# Altium project TL3572-EVM-A1.1-000-SCH-202609041404.PrjPcb (part 2 of 6)

## Sheet P04_POWER01.SchDoc
size 420 x 297 mm
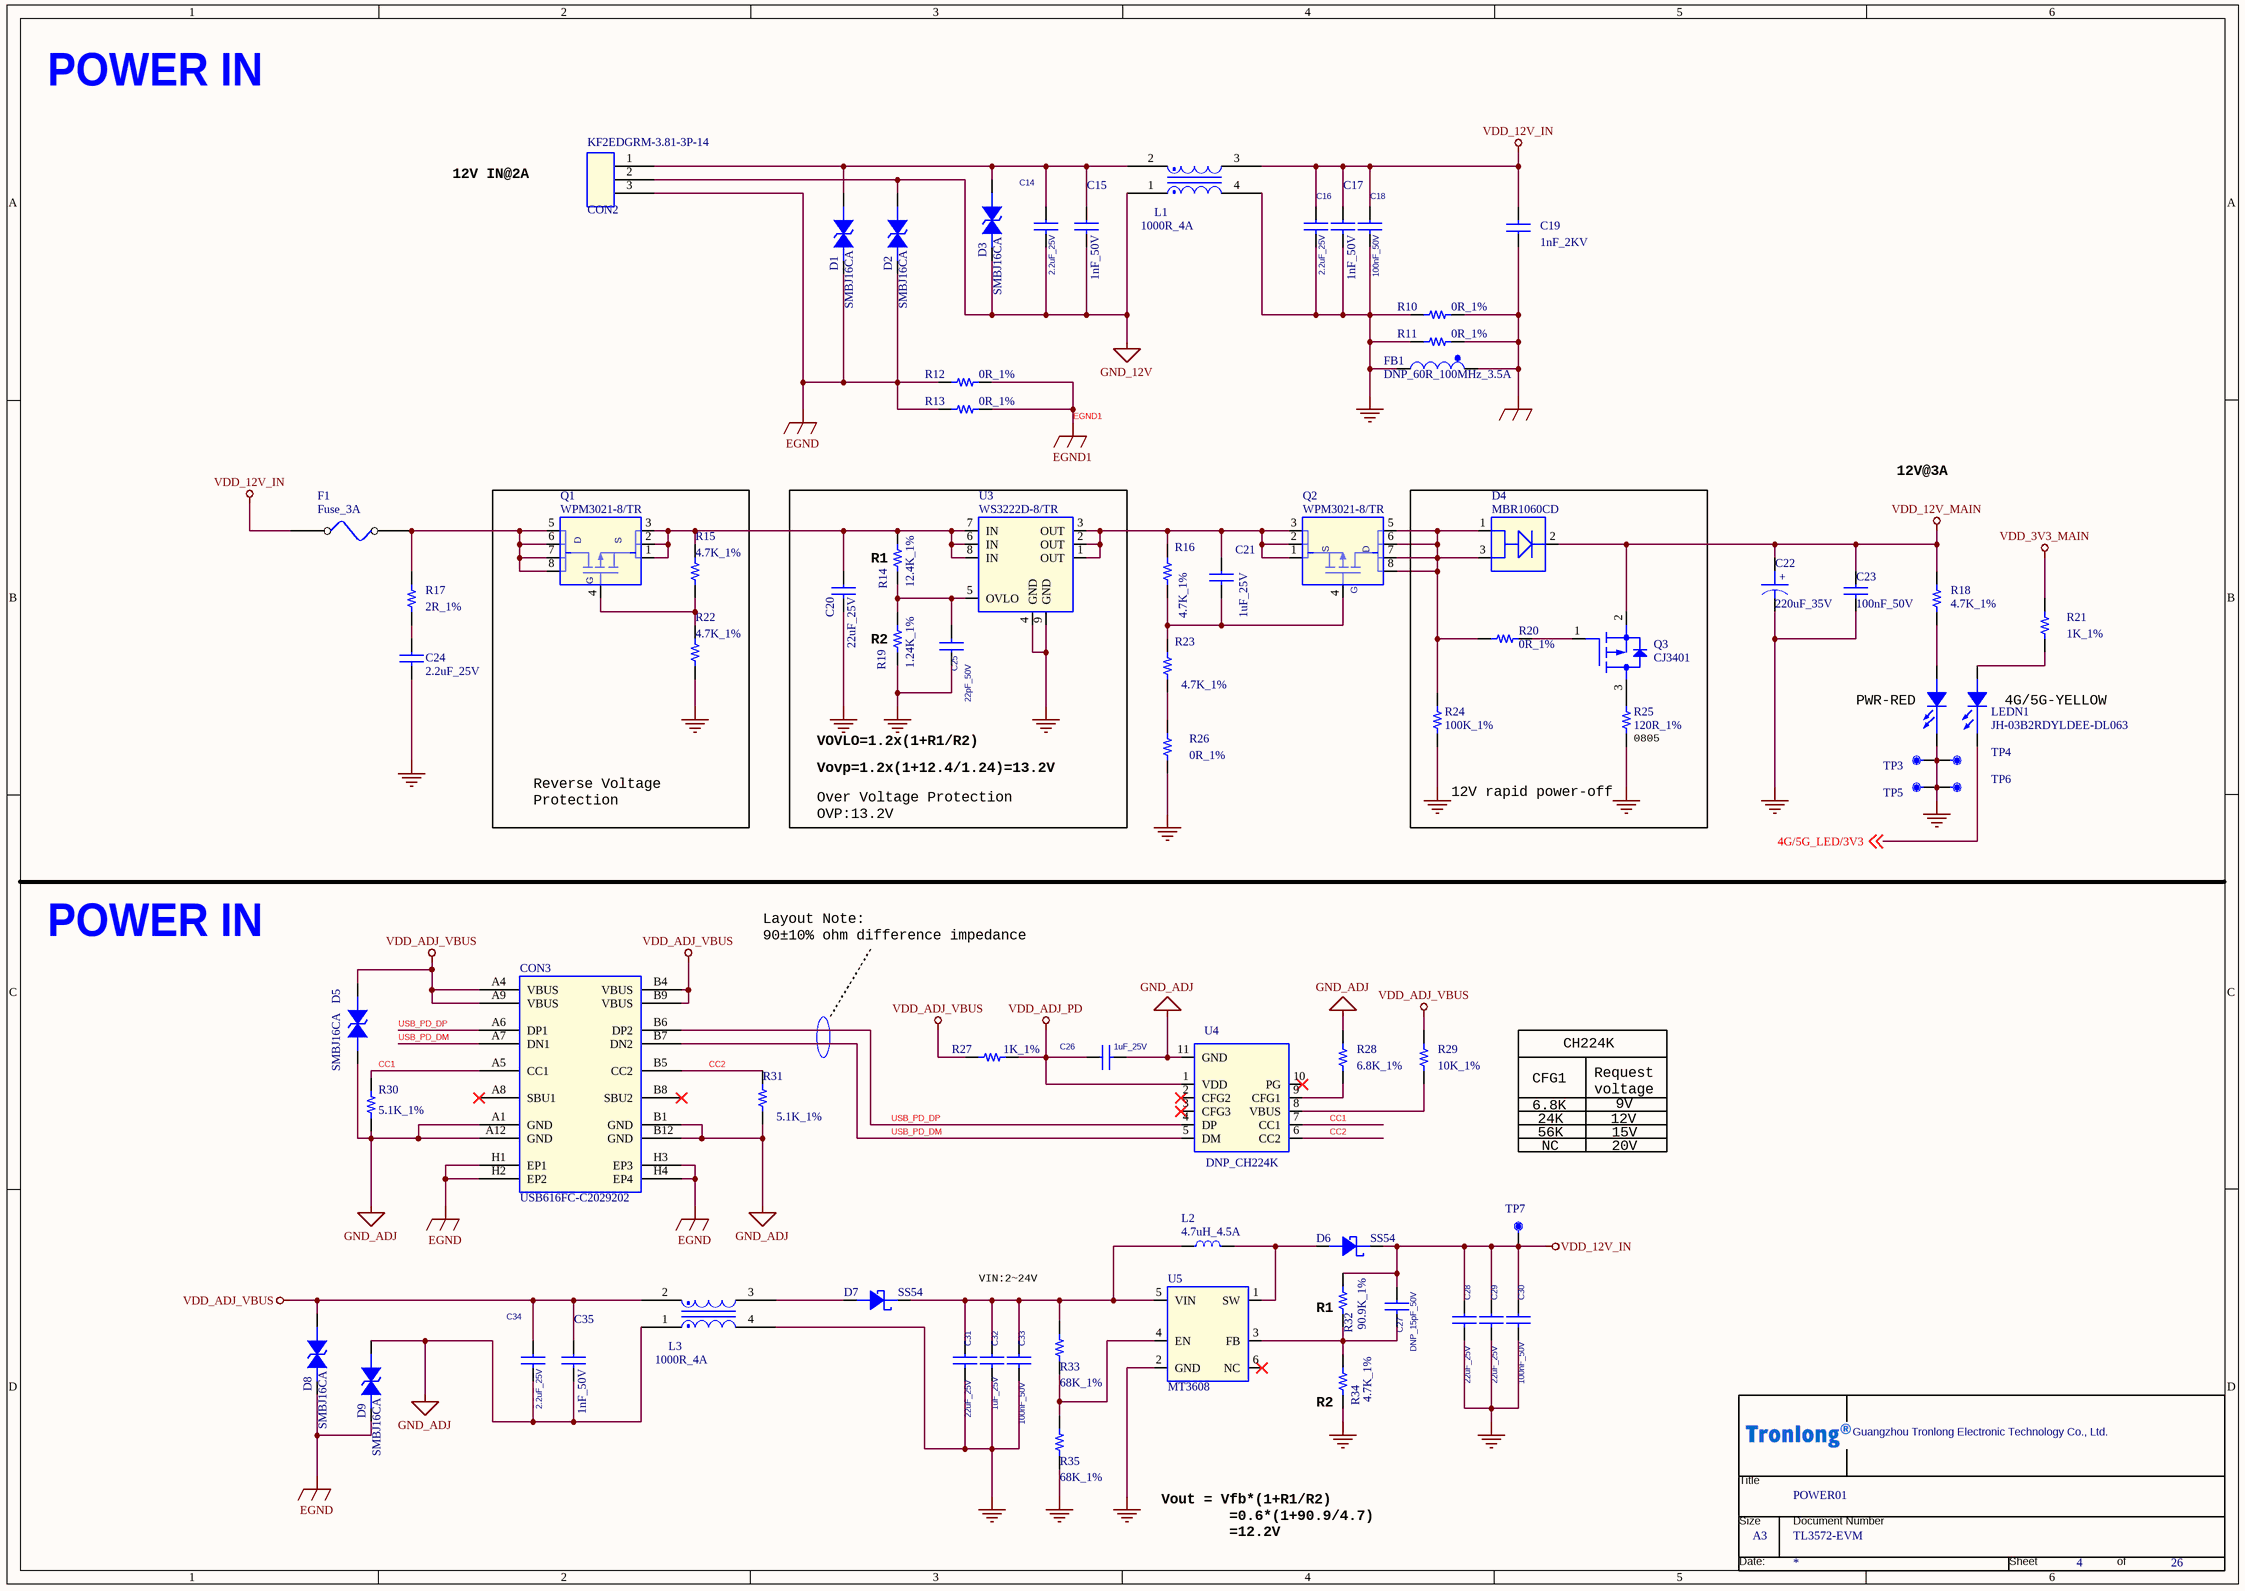
[diagram p6: P04_POWER01.SchDoc]

### Parts
(Parts that share a designator on the sheet are numbered #1, #2 ... from top to bottom, then left to right.)
*#2  Doc: TL3572-EVM  Title: POWER01  OrgName: Guangzhou Tronlong Electronic Technology Co., Ltd.  Page Size: A3  Page Number: 4  Page Count: 26  (hidden comment: Tronlong_TITTLE_20211115)  (graphical)
C14  2.2uF_25V  [C1206]
C15  1nF_50V  [C0402]
C16  2.2uF_25V  [C1206]
C17  1nF_50V  [C0402]
C18  100nF_50V  [C0402]
C19  1nF_2KV  [C1206]
C20  22uF_25V  [C0805]
C21  1uF_25V  [C0402]
C22  220uF_35V  [cap_alu_smd_8x10d5]
C23  100nF_50V  [C0402]
C24  2.2uF_25V  [C1206]
C25  22pF_50V  [C0603]
C26  1uF_25V  [C0402]
C27  DNP_15pF_50V  [C0402]
C28  22uF_25V  [C0805]
C29  22uF_25V  [C0805]
C30  100nF_50V  [C0402]
C31  22uF_25V  [C0805]
C32  1uF_25V  [C0402]
C33  100nF_50V  [C0402]
C34  2.2uF_25V  [C1206]
C35  1nF_50V  [C0402]
CON2  KF2EDGRM-3.81-3P-14  [CON_3P_3D81_90_MALE_A]
CON3  USB616FC-C2029202  [TYPE-C_16P_180_SMD]
D1  SMBJ16CA  [SMB]
D2  SMBJ16CA  [SMB]
D3  SMBJ16CA  [SMB]
D4  MBR1060CD  [TO-252]
D5  SMBJ16CA  [SMB]
D6  SS54  [SMA]
D7  SS54  [SMA]
D8  SMBJ16CA  [SMB]
D9  SMBJ16CA  [SMB]
F1  Fuse_3A  [F1206]
FB1  DNP_60R_100MHz_3.5A  [L0603]
L1  1000R_4A  [SMD-L9070M-4P]
L2  4.7uH_4.5A  [SMD-L5452M-2P]
L3  1000R_4A  [SMD-L9070M-4P]
LEDN1  JH-03B2RDYLDEE-DL063  [led-th_4p-l12d8-w4d6]
Q1  WPM3021-8/TR  [PSOPSOP-8L]
Q2  WPM3021-8/TR  [PSOPSOP-8L]
Q3  CJ3401  [SOT23-3]
R10  0R_1%  [R1206]
R11  0R_1%  [R1206]
R12  0R_1%  [R1206]
R13  0R_1%  [R1206]
R14  12.4K_1%  [R0402]
R15  4.7K_1%  [R0402]
R16  4.7K_1%  [R0402]
R17  2R_1%  [R1210]
R18  4.7K_1%  [R0402]
R19  1.24K_1%  [R0402]
R20  0R_1%  [R0402]
R21  1K_1%  [R0603]
R22  4.7K_1%  [R0402]
R23  4.7K_1%  [R0402]
R24  100K_1%  [R0402]
R25  120R_1%  [R0805]
R26  0R_1%  [R0402]
R27  1K_1%  [R0805]
R28  6.8K_1%  [R0402]
R29  10K_1%  [R0402]
R30  5.1K_1%  [R0402]
R31  5.1K_1%  [R0402]
R32  90.9K_1%  [R0402]
R33  68K_1%  [R0402]
R34  4.7K_1%  [R0402]
R35  68K_1%  [R0402]
TP3  TP-5011  [TP_DIP]  (value not drawn)
TP4  TP-5011  [TP_DIP]  (value not drawn)
TP5  TP-5011  [TP_DIP]  (value not drawn)
TP6  TP-5011  [TP_DIP]  (value not drawn)
TP7  SMT TP  [TP30]  (value not drawn)
U3  WS3222D-8/TR  [DFN2x2-8L]
U4  DNP_CH224K  [ESSOP-10]
U5  MT3608  [SOT-23-6L]

### Blocks framed on the sheet
12V rapid power-off: D4 Q3 R20 R24 R25

### Nets
EGND: C19.1 CON2.3 CON3.H1(EP1) CON3.H2(EP2) CON3.H3(EP3) CON3.H4(EP4) D1.1 D2.1 D8.1 D9.1 FB1.1 R10.2 R11.2 R12.1 R13.1
EGND1: R12.2 R13.2
GND: C16.2 C17.2 C18.2 C20.2 C22.2 C23.2 C24.2 C25.1 C28.2 C29.2 C30.2 C31.2 C32.2 C33.2 FB1.2 L1.4 L3.4 LEDN1.1(CATHODE1) R10.1 R11.1 R19.2 R22.1 R24.1 R25.2 R26.2 R34.1 R35.1 TP3.1 TP4.1 TP5.1 TP6.1 U3.4(GND) U3.9(GND) U5.2(GND)
GND_12V: C14.2 C15.2 CON2.2 D2.2 D3.1 L1.1
GND_ADJ: C26.2 C34.2 C35.2 CON3.A1(GND) CON3.A12(GND) CON3.B1(GND) CON3.B12(GND) D5.1 D9.2 L3.1 R28.1 R30.2 R31.2 U4.11(GND)
VDD_3V3_MAIN: R21.2
VDD_12V_IN: C16.1 C17.1 C18.1 C19.2 C27.1 C28.1 C29.1 C30.1 D6.2(CATHODE) F1.1 L1.3 R32.2 TP7.1
VDD_12V_MAIN: C22.1 C23.1 D4.2 Q3.2(SOURCE) R18.1
VDD_ADJ_PD: C26.1 R27.1 U4.1(VDD)
VDD_ADJ_VBUS: C34.1 C35.1 CON3.A4(VBUS) CON3.A9(VBUS) CON3.B4(VBUS) CON3.B9(VBUS) D5.2 D8.2 L3.2 R27.2 R29.1
4G/5G_LED/3V3: LEDN1.4(CATHODE2) ; off-sheet 4G/5G_LED/3V3
CC1: CON3.A5(CC1) R30.1 U4.7(CC1)
CC2: CON3.B5(CC2) R31.1 U4.6(CC2)
USB_PD_DM: CON3.A7(DN1) CON3.B7(DN2) U4.5(DM)
USB_PD_DP: CON3.A6(DP1) CON3.B6(DP2) U4.4(DP)
NetC14_1: C14.1 C15.1 CON2.1 D1.2 D3.2 L1.2
NetC20_1: C20.1 Q1.1(S1) Q1.2(S2) Q1.3(S3) R14.1 R15.2 U3.6(IN) U3.7(IN) U3.8(IN)
NetC21_1: C21.1 Q2.1(S1) Q2.2(S2) Q2.3(S3) R16.2 U3.1(OUT) U3.2(OUT) U3.3(OUT)
NetC21_2: C21.2 Q2.4(G) R16.1 R23.2
NetC24_1: C24.1 R17.1
NetC25_2: C25.2 R14.2 R19.1 U3.5(OVLO)
NetC27_2: C27.2 R32.1 R34.2 U5.3(FB)
NetC31_1: C31.1 C32.1 C33.1 D7.2(CATHODE) L2.1 R33.2 U5.5(VIN)
NetD4_1: D4.1 D4.3 Q2.5(D1) Q2.6(D2) Q2.7(D3) Q2.8(D4) R20.2 R24.2
NetD6_1: D6.1(ANODE) L2.2 U5.1(SW)
NetD7_1: D7.1(ANODE) L3.3
NetF1_2: F1.2 Q1.5(D1) Q1.6(D2) Q1.7(D3) Q1.8(D4) R17.2
NetLEDN1_2: LEDN1.2(ANODE1) R18.2
NetLEDN1_3: LEDN1.3(ANODE2) R21.1
NetQ1_4: Q1.4(G) R15.1 R22.2
NetQ3_1: Q3.1(GATE) R20.1
NetQ3_3: Q3.3(DRAIN) R25.1
NetR23_1: R23.1 R26.1
NetR28_2: R28.2 U4.9(CFG1)
NetR29_2: R29.2 U4.8(VBUS)
NetR33_1: R33.1 R35.2 U5.4(EN)

Not connected (* = marked no-connect by the designer): CON3 A8(SBU1)* B8(SBU2)*; U4 2(CFG2)* 3(CFG3)* 10(PG)*; U5 6(NC)*

### Notes on the sheet
- POWER IN
- 12V IN@2A
- 12V@3A
- (near R14) R1
- (near R19) R2
- (near LEDN1) PWR-RED
- (near LEDN1) 4G/5G-YELLOW
- Reverse Voltage
  Protection
- VOVLO=1.2x(1+R1/R2)
- Vovp=1.2x(1+12.4/1.24)=13.2V
- (near R25) 0805
- Over Voltage Protection
  OVP:13.2V
- Layout Note:
  90±10% ohm difference impedance
- CH224K
- CFG1
- 6.8K
- 24K
- 56K
- Request
  voltage
- 12V
- 15V
- 9V
- NC
- 20V
- VIN:2~24V
- (near R32) R1
- (near R34) R2
- Vout = Vfb*(1+R1/R2)
  =0.6*(1+90.9/4.7)
  =12.2V
- (in symbol CAP POL_Dup1) +
- (in symbol Tronlong_TITTLE_20211115) Title; Size; Document Number; Date:; Sheet; of
- (in symbol WPM3021) S; D

### Library data of the parts
*#2 = Tronlong_TITTLE_20211115: RevCode: A?; Page Create Date: March  8, 1995; Page Modify Date: *
C14 C16 = CAP NP_Dup2: 贴片陶瓷电容,2.2uF,10%,25V,X7R; Manufacturer: 广东风华高新科技股份有限公司（FH）; Manufacturer PartNumber: 1206B225K250NT; Manufacturer Character: 中国大陆; Eco-Label: ROHS; ERP Number: 005.0001.0001.00646; Operation Temperature（℃）: -55~+125(Ta); As-Welded: /; Part Status: 试用; PCB Footprint: C1206
C15 C35 = CAP NP_Dup3: 贴片陶瓷电容,1nF,10%,50V,X7R; Manufacturer: 广东风华高新科技股份有限公司（FH）; Manufacturer PartNumber: 0402B102K500NT; Manufacturer Character: 中国大陆; Eco-Label: ROHS; ERP Number: 005.0001.0001.00523; Operation Temperature（℃）: -55~+125(Ta); room: KEY; As-Welded: /; PCB Footprint: C0402; Temperature: -55~125℃; Part Status: 优选
C17 = CAP NP_Dup3: 贴片陶瓷电容,1nF,10%,50V,X7R; Manufacturer Character: 中国大陆; Manufacturer PartNumber: 0402B102K500NT; Manufacturer: 广东风华高新科技股份有限公司（FH）; As-Welded: /; room: KEY; Operation Temperature（℃）: -55~+125(Ta); ERP Number: 005.0001.0001.00523; Eco-Label: ROHS; PCB Footprint: C0402; Temperature: -55~125℃; Part Status: 优选
C18 = CAP_NP: 贴片陶瓷电容,100nF,10%,50V,X7R; Manufacturer PartNumber: 0402B104K500NT; Manufacturer: 广东风华高新科技股份有限公司（FH）; Manufacturer Character: 中国大陆; Eco-Label: ROHS; As-Welded: /; Operation Temperature（℃）: -55~+125(Ta); ERP Number: 005.0001.0001.00681; Part Status: 试用; PCB Footprint: C0402
C19 = CAP NP_Dup2: 贴片陶瓷电容,1nF,10%,2KV,X7R; Manufacturer: 广东风华高新科技股份有限公司（FH）; Manufacturer PartNumber: 1206B102K202NT; Manufacturer Character: 中国大陆; Eco-Label: ROHS; As-Welded: /; Operation Temperature（℃）: -55~+125(Ta); ERP Number: 005.0001.0001.00730; PCB Footprint: C1206; Temperature: –55~125℃; Part Status: 试用
C20 = CAP NP_Dup2: 贴片陶瓷电容,22uF,20%,25V,X5R; Manufacturer: 广东风华高新科技股份有限公司（FH）; Manufacturer PartNumber: 0805X226M250NT; Manufacturer Character: 中国大陆; Eco-Label: ROHS; ERP Number: 005.0001.0001.00524; As-Welded: /; Operation Temperature（℃）: -55~+85(Ta); Part Status: 优选; Temperature: -55~125℃; PCB Footprint: C0805
C21 = CAP NP_Dup2: 贴片陶瓷电容,1uF,10%,25V,X5R; Manufacturer PartNumber: 0402X105K250NT; Manufacturer: 广东风华高新科技股份有限公司（FH）; Manufacturer Character: 中国大陆; As-Welded: /; Operation Temperature（℃）: -55~+85(Ta); ERP Number: 005.0001.0001.00640; Eco-Label: ROHS; Part Status: 试用; PCB Footprint: C0402
C22 = CAP POL_Dup1: 贴片式铝电解电容,220uF,20%,35V; Manufacturer PartNumber: RVT1V221M0810VG; Manufacturer: 东莞市合粤电子有限公司（Heyue）; Manufacturer Character: 中国大陆; As-Welded: /; room: DCIN; Operation Temperature（℃）: -55~+105(Ta); ERP Number: 005.0001.0001.00586; Eco-Label: ROHS; Temperature: -55~105℃; Part Status: 优选; PCB Footprint: cap_alu_smd_8x10d5
C23 = CAP NP_Dup2: 贴片陶瓷电容,100nF,10%,50V,X7R; Manufacturer PartNumber: 0402B104K500NT; Manufacturer: 广东风华高新科技股份有限公司（FH）; Manufacturer Character: 中国大陆; As-Welded: /; Operation Temperature（℃）: -55~+125(Ta); room: DCIN; ERP Number: 005.0001.0001.00681; Eco-Label: ROHS; Temperature: -55~125℃; Part Status: 试用; PCB Footprint: C0402
C24 = CAP NP_Dup2: 贴片陶瓷电容,2.2uF,10%,25V,X7R; Manufacturer: 广东风华高新科技股份有限公司（FH）; Manufacturer PartNumber: 1206B225K250NT; Manufacturer Character: 中国大陆; As-Welded: /; Operation Temperature（℃）: -55~+125(Ta); ERP Number: 005.0001.0001.00646; Eco-Label: ROHS; Part Status: 试用; PCB Footprint: C1206
C25 = CAP NP_Dup2: 贴片陶瓷电容,22pF,5%,50V,COG; Manufacturer PartNumber: 0603CG220J500NT; Manufacturer: 广东风华高新科技股份有限公司（FH）; Manufacturer Character: 中国大陆; As-Welded: /; Operation Temperature（℃）: -55~+125(Ta); ERP Number: 005.0001.0001.00542; Eco-Label: EXEMPTION; Temperature: -55~125℃; Part Status: 优选; PCB Footprint: C0603
C26 = CAP NP_Dup2: 贴片陶瓷电容,1uF,10%,25V,X5R; Manufacturer PartNumber: 0402X105K250NT; Manufacturer: 广东风华高新科技股份有限公司（FH）; Manufacturer Character: 中国大陆; Eco-Label: ROHS; ERP Number: 005.0001.0001.00640; As-Welded: /; Operation Temperature（℃）: -55~+85(Ta); Part Status: 试用; PCB Footprint: C0402
C27 = CAP NP_Dup2: 贴片陶瓷电容,15pF,5%,50V,COG; Manufacturer Character: 中国大陆; Manufacturer: 广东风华高新科技股份有限公司（FH）; Manufacturer PartNumber: 0402CG150J500NT; Eco-Label: ROHS; Operation Temperature（℃）: -55~+125(Ta); As-Welded: DNP; ERP Number: 005.0001.0001.00665; Part Status: 试用; Temperature: -55~125℃; PCB Footprint: C0402
C28 = CAP NP_Dup2: 贴片陶瓷电容,22uF,20%,25V,X5R; Manufacturer: 广东风华高新科技股份有限公司（FH）; Manufacturer PartNumber: 0805X226M250NT; Manufacturer Character: 中国大陆; As-Welded: /; Operation Temperature（℃）: -55~+85(Ta); ERP Number: 005.0001.0001.00524; Eco-Label: ROHS; Temperature: -55~125℃; Part Status: 优选; PCB Footprint: C0805
C29 C31 = CAP NP_Dup2: 贴片陶瓷电容,22uF,20%,25V,X5R; Manufacturer: 广东风华高新科技股份有限公司（FH）; Manufacturer PartNumber: 0805X226M250NT; Manufacturer Character: 中国大陆; Eco-Label: ROHS; ERP Number: 005.0001.0001.00524; Operation Temperature（℃）: -55~+85(Ta); As-Welded: /; Temperature: -55~125℃; Part Status: 优选; PCB Footprint: C0805
C30 = CAP NP_Dup2: 贴片陶瓷电容,100nF,10%,50V,X7R; Manufacturer Character: 中国大陆; Manufacturer: 广东风华高新科技股份有限公司（FH）; Manufacturer PartNumber: 0402B104K500NT; Operation Temperature（℃）: -55~+125(Ta); As-Welded: /; ERP Number: 005.0001.0001.00681; Eco-Label: ROHS; Part Status: 试用; Temperature: -55~125℃; PCB Footprint: C0402
C32 = CAP NP_Dup2: 贴片陶瓷电容,1uF,10%,25V,X5R; Manufacturer PartNumber: 0402X105K250NT; Manufacturer: 广东风华高新科技股份有限公司（FH）; Manufacturer Character: 中国大陆; Operation Temperature（℃）: -55~+85(Ta); As-Welded: /; ERP Number: 005.0001.0001.00640; Eco-Label: ROHS; Part Status: 试用; PCB Footprint: C0402
C33 = CAP NP_Dup2: 贴片陶瓷电容,100nF,10%,50V,X7R; Manufacturer PartNumber: 0402B104K500NT; Manufacturer: 广东风华高新科技股份有限公司（FH）; Manufacturer Character: 中国大陆; Operation Temperature（℃）: -55~+125(Ta); As-Welded: /; ERP Number: 005.0001.0001.00681; Eco-Label: ROHS; Part Status: 试用; Temperature: -55~125℃; PCB Footprint: C0402
C34 = CAP NP_Dup2: 贴片陶瓷电容,2.2uF,10%,25V,X7R; Manufacturer: 广东风华高新科技股份有限公司（FH）; Manufacturer PartNumber: 1206B225K250NT; Manufacturer Character: 中国大陆; ERP Number: 005.0001.0001.00646; Operation Temperature（℃）: -55~+125(Ta); As-Welded: /; Eco-Label: ROHS; Part Status: 试用; PCB Footprint: C1206
CON2 = CON3_Dup1: 插拔式端子座,1x3P,3.81mm,90度,带法兰; Manufacturer: 慈溪市科发电子有限公司（KEFA）; Manufacturer Character: 中国大陆; As-Welded: /; room: 17; Operation Temperature（℃）: -40~+105(Ta); ERP Number: 005.0001.0003.00144; Eco-Label: ROHS; Manufacturer PartNumber: KF2EDGRM-3.81-3P-14; Part Status: 试用; PCB Footprint: CON_3P_3D81_90_MALE_A
CON3 = usb 3_0.0 type-c female: Type-C座,16P,0.8mm,母座,侧贴; Manufacturer Character: 中国大陆; Manufacturer: 深圳市爱特姆科技有限公司（ATOM）; Eco-Label: ROHS; ERP Number: 005.0001.0003.00751; As-Welded: /; room: 10; Operation Temperature（℃）: -40~85(Ta); Temperature: -40~85℃; Manufacturer PartNumber: USB616FC-C2029202; Part Status: 试用; PCB Footprint: TYPE-C_16P_180_SMD
D1 D8 D9 = DIODE-TRIG: TVS二极管,VRWM=16V,VBR=17.8V,一组,双向; Manufacturer Character: 中国大陆; Manufacturer: 江苏长晶科技有限公司（JSCJ）; Eco-Label: ROHS; As-Welded: /; Operation Temperature（℃）: -55~+150(Tj); room: DCIN; ERP Number: 005.0001.0017.00077; Part Status: 试用; Temperature: -55~150℃; Manufacturer PartNumber: SMBJ16CA; PCB Footprint: SMB
D2 D3 = DIODE-TRIG: TVS二极管,VRWM=16V,VBR=17.8V,一组,双向; Manufacturer: 江苏长晶科技有限公司（JSCJ）; Manufacturer Character: 中国大陆; ERP Number: 005.0001.0017.00077; room: DCIN; Operation Temperature（℃）: -55~+150(Tj); As-Welded: /; Eco-Label: ROHS; Part Status: 试用; Manufacturer PartNumber: SMBJ16CA; Temperature: -55~150℃; PCB Footprint: SMB
D4 = MBRB1045_0: 肖特基二极管,VR=60V,IF=10A,VF=0.75V@5A,两路; Manufacturer Character: 中国大陆; Manufacturer: 山东芯诺电子科技股份有限公司（xnelec）; Eco-Label: ROHS; ERP Number: 005.0001.0010.00133; Operation Temperature（℃）: -55~+150(Tj); As-Welded: /; Part Status: 试用; Manufacturer PartNumber: MBR1060CD; Temperature: -55~150℃; PCB Footprint: TO-252
D5 = DIODE-TRIG: TVS二极管,VRWM=16V,VBR=17.8V,一组,双向; Manufacturer: 江苏长晶科技股份有限公司（JSCJ）; Manufacturer Character: 中国大陆; Eco-Label: ROHS; ERP Number: 005.0001.0017.00077; room: DCIN; Operation Temperature（℃）: -55~+150(Tj); As-Welded: /; Part Status: 试用; Manufacturer PartNumber: SMBJ16CA; Temperature: -55~150℃; PCB Footprint: SMB
D6 = DIODE SCHOTTKY: 肖特基二极管,VR=40V,IF=5A,VF=0.55V@5A; Manufacturer Character: 中国大陆; Manufacturer: 江苏长晶科技股份有限公司（JSCJ）; Eco-Label: ROHS; ERP Number: 005.0001.0010.00098; Operation Temperature（℃）: -55~+125(Tj); As-Welded: /; Part Status: 试用; Temperature: -55~125℃; Manufacturer PartNumber: SS54; PCB Footprint: SMA
D7 = DIODE SCHOTTKY: 肖特基二极管,VR=40V,IF=5A,VF=0.55V@5A; Manufacturer: 江苏长晶科技股份有限公司（JSCJ）; Manufacturer Character: 中国大陆; As-Welded: /; Operation Temperature（℃）: -55~+125(Tj); ERP Number: 005.0001.0010.00098; Eco-Label: ROHS; Manufacturer PartNumber: SS54; Temperature: -55~125℃; Part Status: 试用; PCB Footprint: SMA
F1 = FUSE: 保险丝，Vmax=72V,Imax=50A,Ihold=3A; Manufacturer Character: 中国大陆; Manufacturer: 东莞市竞沃电子科技有限公司（TLC）; Manufacturer PartNumber: F12T3; Eco-Label: ROHS; ERP Number: 005.0001.0011.00036; Operation Temperature（℃）: -55~+125(Ta); As-Welded: /; Part Status: 试用; Temperature: -55~125℃; PCB Footprint: F1206
FB1 = FERRITE BEAD_Dup1: 磁珠,20mΩ,3.5A,60R@100MHz; Manufacturer: TDK(日本东电化); Manufacturer PartNumber: MPZ1608S600ATAH0; Manufacturer Character: 国外; ERP Number: 005.0001.0007.00008; Operation Temperature（℃）: -55~125(Ta); As-Welded: DNP; Eco-Label: ROHS; Part Status: 优选; Temperature: -55~125℃; PCB Footprint: L0603
L1 L3 = ACM1211-701-2PL-TL01: 贴片共模电感,13mΩ,4A,50V,1000Ω@100MHz; Manufacturer Character: 中国大陆; Manufacturer: 深圳市宏业兴电子有限公司（HONGYEX）; Part Number: G11.00002; Manufacturer PartNumber: CMF9070F-102-2P-T; Eco-Label: ROHS; Operation Temperature（℃）: -40~+85(Ta); As-Welded: /; ERP Number: 005.0001.0006.00183; PCB Footprint: SMD-L9070M-4P; Price: 0; Part Type: 共模电感; Part Status: 优选
L2 = 1211_CHOKE_0: 贴片功率电感,4.7uH,0.060Ω,Isat=5A,Irms=4.5A; Manufacturer Character: 中国大陆; Manufacturer: 深圳市长江微电科技有限公司（Cjiang）; Manufacturer PartNumber: FXL0530-4R7M; CLASS: DISCRETE; Operation Temperature（℃）: -55~+125(Ta); Current: 5A; As-Welded: /; ERP Number: 005.0001.0006.00167; Eco-Label: ROHS; Temperature: -40~125℃; Part Status: 测评; PCB Footprint: SMD-L5452M-2P
LEDN1 = LED_4: 直插式发光二极管,绿色,带灯座; Manufacturer Character: 中国大陆; Manufacturer: 深圳市巨弘光电有限公司（JUHLIGHT）; Manufacturer PartNumber: JH-03B2YG1E-DL; Eco-Label: ROHS; ERP Number: 005.0001.0010.00148; As-Welded: /; Operation Temperature（℃）: -40~+100(Ta); Part Status: 试用; Temperature: -40~105℃; PCB Footprint: led-th_4p-l12d8-w4d6
Q1 = WPM3021: MOSFET,P沟道,VDSS=-30V,VGSS=±25V,ID=-13A,PD=3.8W,VGS(th)=-3V; Manufacturer: 上海韦尔半导体股份有限公司（WILLSEMI）; Manufacturer Character: 中国大陆; Eco-Label: ROHS; ERP Number: 005.0001.0009.00030; As-Welded: /; Operation Temperature（℃）: -55~+150(Tj); Part Status: 优选; Temperature: -40~85℃; Manufacturer PartNumber: WPM3021-8/TR; PCB Footprint: PSOPSOP-8L
Q2 = WPM3021: MOSFET,P沟道,VDSS=-30V,VGSS=±25V,ID=-13A,PD=3.8W,VGS(th)=-3V; Manufacturer Character: 中国大陆; Manufacturer: 上海韦尔半导体股份有限公司（WILLSEMI）; Eco-Label: ROHS; ERP Number: 005.0001.0009.00030; As-Welded: /; Operation Temperature（℃）: -55~+150(Tj); Part Status: 优选; Manufacturer PartNumber: WPM3021-8/TR; Temperature: -40~85℃; PCB Footprint: PSOPSOP-8L
Q3 = MOSFET P SOT: MOSFET,P沟道,VDSS=-30V,VGSS=±12V,ID=-4.2A,PD=0.35W,VGS(th)=-1.3V; Manufacturer: 江苏长晶科技股份有限公司（JSCJ）; Manufacturer Character: 中国大陆; room: DCIN; Operation Temperature（℃）: -55~+150(Tj); As-Welded: /; ERP Number: 005.0001.0009.00015; Eco-Label: ROHS; Temperature: -55~150℃; Manufacturer Part Number: CJ3401; Manufacturer PartNumber: CJ3401; Part Status: 优选; PCB Footprint: SOT23-3
R10 R11 R13 = Resistor_Dup3: 贴片电阻,0R,±1%,1/4W; Manufacturer Character: 中国大陆; Manufacturer PartNumber: RS-06000FT; Manufacturer: 广东风华高新科技股份有限公司（FH）; CLASS: DISCRETE; Eco-Label: ROHS; As-Welded: /; room: USB HUB; Operation Temperature（℃）: -55~+155(Ta); ERP Number: 005.0001.0002.01440; Part Status: 测评; PCB Footprint: R1206
R12 = Resistor_Dup3: 贴片电阻,0R,±1%,1/4W; Manufacturer: 广东风华高新科技股份有限公司（FH）; Manufacturer PartNumber: RS-06000FT; Manufacturer Character: 中国大陆; CLASS: DISCRETE; ERP Number: 005.0001.0002.01440; Operation Temperature（℃）: -55~+155(Ta); room: USB HUB; As-Welded: /; Eco-Label: ROHS; Part Status: 测评; PCB Footprint: R1206
R14 = Resistor_Dup3: 0402WGF1242TCE; Manufacturer PartNumber: 12.4K,±1%,R0402,≥1/16W; Manufacturer: 广州创龙; CLASS: DISCRETE; Operation Temperature（℃）: -40~+85(Ta); As-Welded: /; ERP Number: 005.0001.0023.00040; Eco-Label: ROHS; Temperature: -55~155℃; Manufacturer Character: -; Part Status: -; PCB Footprint: R0402
R15 = Resistor_Dup3: 贴片电阻,4.7K,±1%,1/16W; Manufacturer Character: 中国大陆; Manufacturer PartNumber: RC-02K4701FT; Manufacturer: 广东风华高新科技股份有限公司（FH）; CLASS: DISCRETE; Eco-Label: ROHS; ERP Number: 005.0001.0002.01359; Operation Temperature（℃）: -55~+125(Ta); As-Welded: /; Part Status: 试用; Temperature: -55~155℃; PCB Footprint: R0402
R16 = Resistor_Dup3: 贴片电阻,4.7K,±1%,1/16W; Manufacturer PartNumber: RC-02K4701FT; Manufacturer: 广东风华高新科技股份有限公司（FH）; Manufacturer Character: 中国大陆; CLASS: DISCRETE; Eco-Label: ROHS; ERP Number: 005.0001.0002.01359; Operation Temperature（℃）: -55~+125(Ta); As-Welded: /; Part Status: 试用; Temperature: -55~155℃; PCB Footprint: R0402
R17 = Resistor_Dup3: 贴片电阻,2R,±1%,1/3W; Manufacturer Character: 中国大陆; Manufacturer PartNumber: RS-1210L2R00FT; Manufacturer: 广东风华高新科技股份有限公司（FH）; CLASS: DISCRETE; As-Welded: /; Operation Temperature（℃）: -55~+155(Ta); ERP Number: 005.0001.0002.01281; Eco-Label: ROHS; Part Status: 试用; PCB Footprint: R1210
R18 = Resistor_Dup3: 贴片电阻,4.7K,±1%,1/16W; Manufacturer: 广东风华高新科技股份有限公司（FH）; Manufacturer PartNumber: RC-02K4701FT; Manufacturer Character: 中国大陆; CLASS: DISCRETE; As-Welded: /; room: DCIN; Operation Temperature（℃）: -55~+125(Ta); ERP Number: 005.0001.0002.01359; Eco-Label: ROHS; Part Status: 试用; PCB Footprint: R0402
R19 = Resistor_Dup3: 贴片电阻,1.24K,±1%,1/16W; Manufacturer Character: 中国大陆; Manufacturer: 广东风华高新科技股份有限公司（FH）; Manufacturer PartNumber: RC-02K1241FT; CLASS: DISCRETE; Eco-Label: ROHS; ERP Number: 005.0001.0002.01456; As-Welded: /; Operation Temperature（℃）: -55~+155(Ta); Part Status: 测评; PCB Footprint: R0402
R20 R26 = Resistor_Dup3: 贴片电阻,0R,±1%,1/16W; Manufacturer: 广东风华高新科技股份有限公司（FH）; Manufacturer PartNumber: RC-02000FT; Manufacturer Character: 中国大陆; CLASS: DISCRETE; As-Welded: /; Operation Temperature（℃）: -55~+155(Ta); ERP Number: 005.0001.0002.00938; Eco-Label: ROHS; Part Status: 优选; PCB Footprint: R0402
R21 = Resistor_Dup3: 贴片电阻,1K,±1%,1/10W; Manufacturer: 广东风华高新科技股份有限公司（FH）; Manufacturer PartNumber: RS-03K1001FT; Manufacturer Character: 中国大陆; CLASS: DISCRETE; Eco-Label: ROHS; ERP Number: 005.0001.0002.00961; room: USB HUB; Operation Temperature（℃）: -55~+155(Ta); As-Welded: /; Part Status: 优选; PCB Footprint: R0603
R22 = Resistor_Dup3: 贴片电阻,4.7K,±1%,1/16W; Manufacturer: 广东风华高新科技股份有限公司（FH）; Manufacturer PartNumber: RC-02K4701FT; Manufacturer Character: 中国大陆; CLASS: DISCRETE; Eco-Label: ROHS; ERP Number: 005.0001.0002.01359; As-Welded: /; Operation Temperature（℃）: -55~+125(Ta); Part Status: 试用; Temperature: -55~155℃; PCB Footprint: R0402
R23 = Resistor_Dup3: 贴片电阻,4.7K,±1%,1/16W; Manufacturer Character: 中国大陆; Manufacturer: 广东风华高新科技股份有限公司（FH）; Manufacturer PartNumber: RC-02K4701FT; CLASS: DISCRETE; As-Welded: /; Operation Temperature（℃）: -55~+125(Ta); ERP Number: 005.0001.0002.01359; Eco-Label: ROHS; Temperature: -55~155℃; Part Status: 试用; PCB Footprint: R0402
R24 = Resistor_Dup3: RC0402FR-07100KL,0402WGF1003TCE; Manufacturer: 广州创龙; Manufacturer PartNumber: 100K,±1%,R0402,≥1/16W; CLASS: DISCRETE; Eco-Label: ROHS; As-Welded: /; Operation Temperature（℃）: -40~+85(Ta); ERP Number: 005.0001.0023.00025; Part Status: -; Manufacturer Character: -; Temperature: -55~155℃; PCB Footprint: R0402
R25 = Resistor_Dup3: 贴片电阻,120R,±1%,1/8W; Manufacturer: 广东风华高新科技股份有限公司（FH）; Manufacturer PartNumber: RS-05K1200FT; Manufacturer Character: 中国大陆; CLASS: DISCRETE; Eco-Label: ROHS; ERP Number: 005.0001.0002.01050; room: DCIN; Operation Temperature（℃）: -55~+155(Ta); As-Welded: /; Part Status: 优选; Temperature: -55~155℃; PCB Footprint: R0805
R27 = Resistor_Dup3: 贴片电阻,1K,±1%,1/8W; Manufacturer PartNumber: RS-05K1001FT; Manufacturer: 广东风华高新科技股份有限公司（FH）; Manufacturer Character: 中国大陆; CLASS: DISCRETE; Eco-Label: ROHS; ERP Number: 005.0001.0002.01425; Operation Temperature（℃）: -55~+155(Ta); As-Welded: /; Part Status: 测评; PCB Footprint: R0805
R28 = Resistor_Dup3: 贴片电阻,6.8K,±1%,1/16W; Manufacturer Character: 中国大陆; Manufacturer: 广东风华高新科技股份有限公司（FH）; Manufacturer PartNumber: RC-02K6801FT; CLASS: DISCRETE; Eco-Label: ROHS; ERP Number: 005.0001.0002.01367; As-Welded: /; Operation Temperature（℃）: -55~+125(Ta); Part Status: 试用; PCB Footprint: R0402
R29 = Resistor_Dup3: 贴片电阻,10K,±1%,1/16W; Manufacturer Character: 中国大陆; Manufacturer: 广东风华高新科技股份有限公司（FH）; Manufacturer PartNumber: RC-02K1002FT; CLASS: DISCRETE; As-Welded: /; Operation Temperature（℃）: -55~+125(Ta); ERP Number: 005.0001.0002.01326; Eco-Label: ROHS; Part Status: 优选; PCB Footprint: R0402
R30 = Resistor_Dup3: 贴片电阻,5.1K,±1%,1/16W; Manufacturer: 广东风华高新科技股份有限公司（FH）; Manufacturer PartNumber: RC-02K5101FT; Manufacturer Character: 中国大陆; CLASS: DISCRETE; Operation Temperature（℃）: -55~+155(Ta); room: JTAG; As-Welded: /; ERP Number: 005.0001.0002.01049; Eco-Label: ROHS; Temperature: -55~125℃; Part Status: 优选; PCB Footprint: R0402
R31 = Resistor_Dup3: 贴片电阻,5.1K,±1%,1/16W; Manufacturer Character: 中国大陆; Manufacturer: 广东风华高新科技股份有限公司（FH）; Manufacturer PartNumber: RC-02K5101FT; CLASS: DISCRETE; As-Welded: /; room: JTAG; Operation Temperature（℃）: -55~+155(Ta); ERP Number: 005.0001.0002.01049; Eco-Label: ROHS; Part Status: 优选; Temperature: -55~125℃; PCB Footprint: R0402
R32 = Resistor_Dup3: 贴片电阻,90.9K,±1%,1/16W; Manufacturer: 广东风华高新科技股份有限公司（FH）; Manufacturer PartNumber: RC-02K9092FT; Manufacturer Character: 中国大陆; CLASS: DISCRETE; As-Welded: /; Operation Temperature（℃）: -55~+125(Ta); ERP Number: 005.0001.0002.01406; Eco-Label: ROHS; Temperature: -55~155℃; Part Status: 试用; PCB Footprint: R0402
R33 = Resistor_Dup3: 贴片电阻,68K,±1%,1/16W; Manufacturer PartNumber: RC-02K6802FT; Manufacturer: 广东风华高新科技股份有限公司（FH）; Manufacturer Character: 中国大陆; CLASS: DISCRETE; Operation Temperature（℃）: -55~+155(Ta); As-Welded: /; ERP Number: 005.0001.0002.01426; Eco-Label: ROHS; Temperature: -55~155℃; Part Status: 测评; PCB Footprint: R0402
R34 = Resistor_Dup3: 贴片电阻,4.7K,±1%,1/16W; Manufacturer Character: 中国大陆; Manufacturer PartNumber: RC-02K4701FT; Manufacturer: 广东风华高新科技股份有限公司（FH）; CLASS: DISCRETE; Operation Temperature（℃）: -55~+125(Ta); As-Welded: /; ERP Number: 005.0001.0002.01359; Eco-Label: ROHS; Part Status: 试用; Temperature: -55~155℃; PCB Footprint: R0402
R35 = Resistor_Dup3: 贴片电阻,68K,±1%,1/16W; Manufacturer Character: 中国大陆; Manufacturer: 广东风华高新科技股份有限公司（FH）; Manufacturer PartNumber: RC-02K6802FT; CLASS: DISCRETE; As-Welded: /; Operation Temperature（℃）: -55~+155(Ta); ERP Number: 005.0001.0002.01426; Eco-Label: ROHS; Temperature: -55~155℃; Part Status: 测评; PCB Footprint: R0402
TP3 TP4 = TP-S40: 黑色直插测试柱; Manufacturer: 深圳市保定五金塑胶有限公司; Manufacturer Character: 中国大陆; Characteristic: Test point,diameter=1.0mm; Operation Temperature（℃）: -40~+85(Ta); As-Welded: /; ERP Number: 005.0001.0019.00030; Eco-Label: ROHS; Manufacturer PartNumber: TP-5011; Part Status: 试用; PCB Footprint: TP_DIP
TP5 = TP-S40: 黑色直插测试柱; Manufacturer Character: 中国大陆; Manufacturer: 深圳市保定五金塑胶有限公司; Characteristic: Test point,diameter=1.0mm; Eco-Label: ROHS; ERP Number: 005.0001.0019.00030; As-Welded: /; Operation Temperature（℃）: -40~+85(Ta); Part Status: 试用; Manufacturer PartNumber: TP-5011; PCB Footprint: TP_DIP
TP6 = TP-S40: 黑色直插测试柱; Manufacturer Character: 中国大陆; Manufacturer: 深圳市保定五金塑胶有限公司; Characteristic: Test point,diameter=1.0mm; Operation Temperature（℃）: -40~+85(Ta); As-Welded: /; ERP Number: 005.0001.0019.00030; Eco-Label: ROHS; Manufacturer PartNumber: TP-5011; Part Status: 试用; PCB Footprint: TP_DIP
TP7 = TP-S40: /; Manufacturer Character: 中国大陆; Characteristic: Test point,diameter=1.0mm; As-Welded: DNP; Manufacturer PartNumber: /; Manufacturer: /; Operation Temperature（℃）: /; PCB Footprint: TP30
U3 = WS3222D-8/TR: 过压保护开关,VCC=2.5V~28V,过压保护阈值4V~15V可调; Manufacturer: 上海韦尔半导体股份有限公司（WILLSEMI）; Manufacturer Character: 中国大陆; Eco-Label: ROHS; ERP Number: 005.0001.0004.00643; Operation Temperature（℃）: -40~+85(Ta); As-Welded: /; Part Status: 优选; Manufacturer PartNumber: WS3222D-8/TR; Temperature: -40~85℃; PCB Footprint: DFN2x2-8L
U4 = CH224K: USB Type-C PD 受电芯片; Manufacturer: 南京沁恒微电子股份有限公司（WCH）; Manufacturer Character: 中国大陆; Eco-Label: ROHS; ERP Number: 005.0001.0004.01153; Operation Temperature（℃）: -40~+90(Ta); As-Welded: DNP; Part Status: 测评; Manufacturer PartNumber: CH224K; PCB Footprint: ESSOP-10
U5 = WD1304E30_17: DC/DC,Boost,Vin:2V~24V,Vout:2V~28V,4A,1路; Manufacturer Character: 中国大陆; Manufacturer: 西安航天民芯科技有限公司(aerosemi); Eco-Label: ROHS; ERP Number: 005.0001.0004.01152; As-Welded: /; Operation Temperature（℃）: -40~+85(Ta); Manufacturer PartNumber: MT3608; Temperature: -40~85℃; Part Status: 测评; PCB Footprint: SOT-23-6L

## Sheet P05_POWER02.SchDoc
size 420 x 297 mm
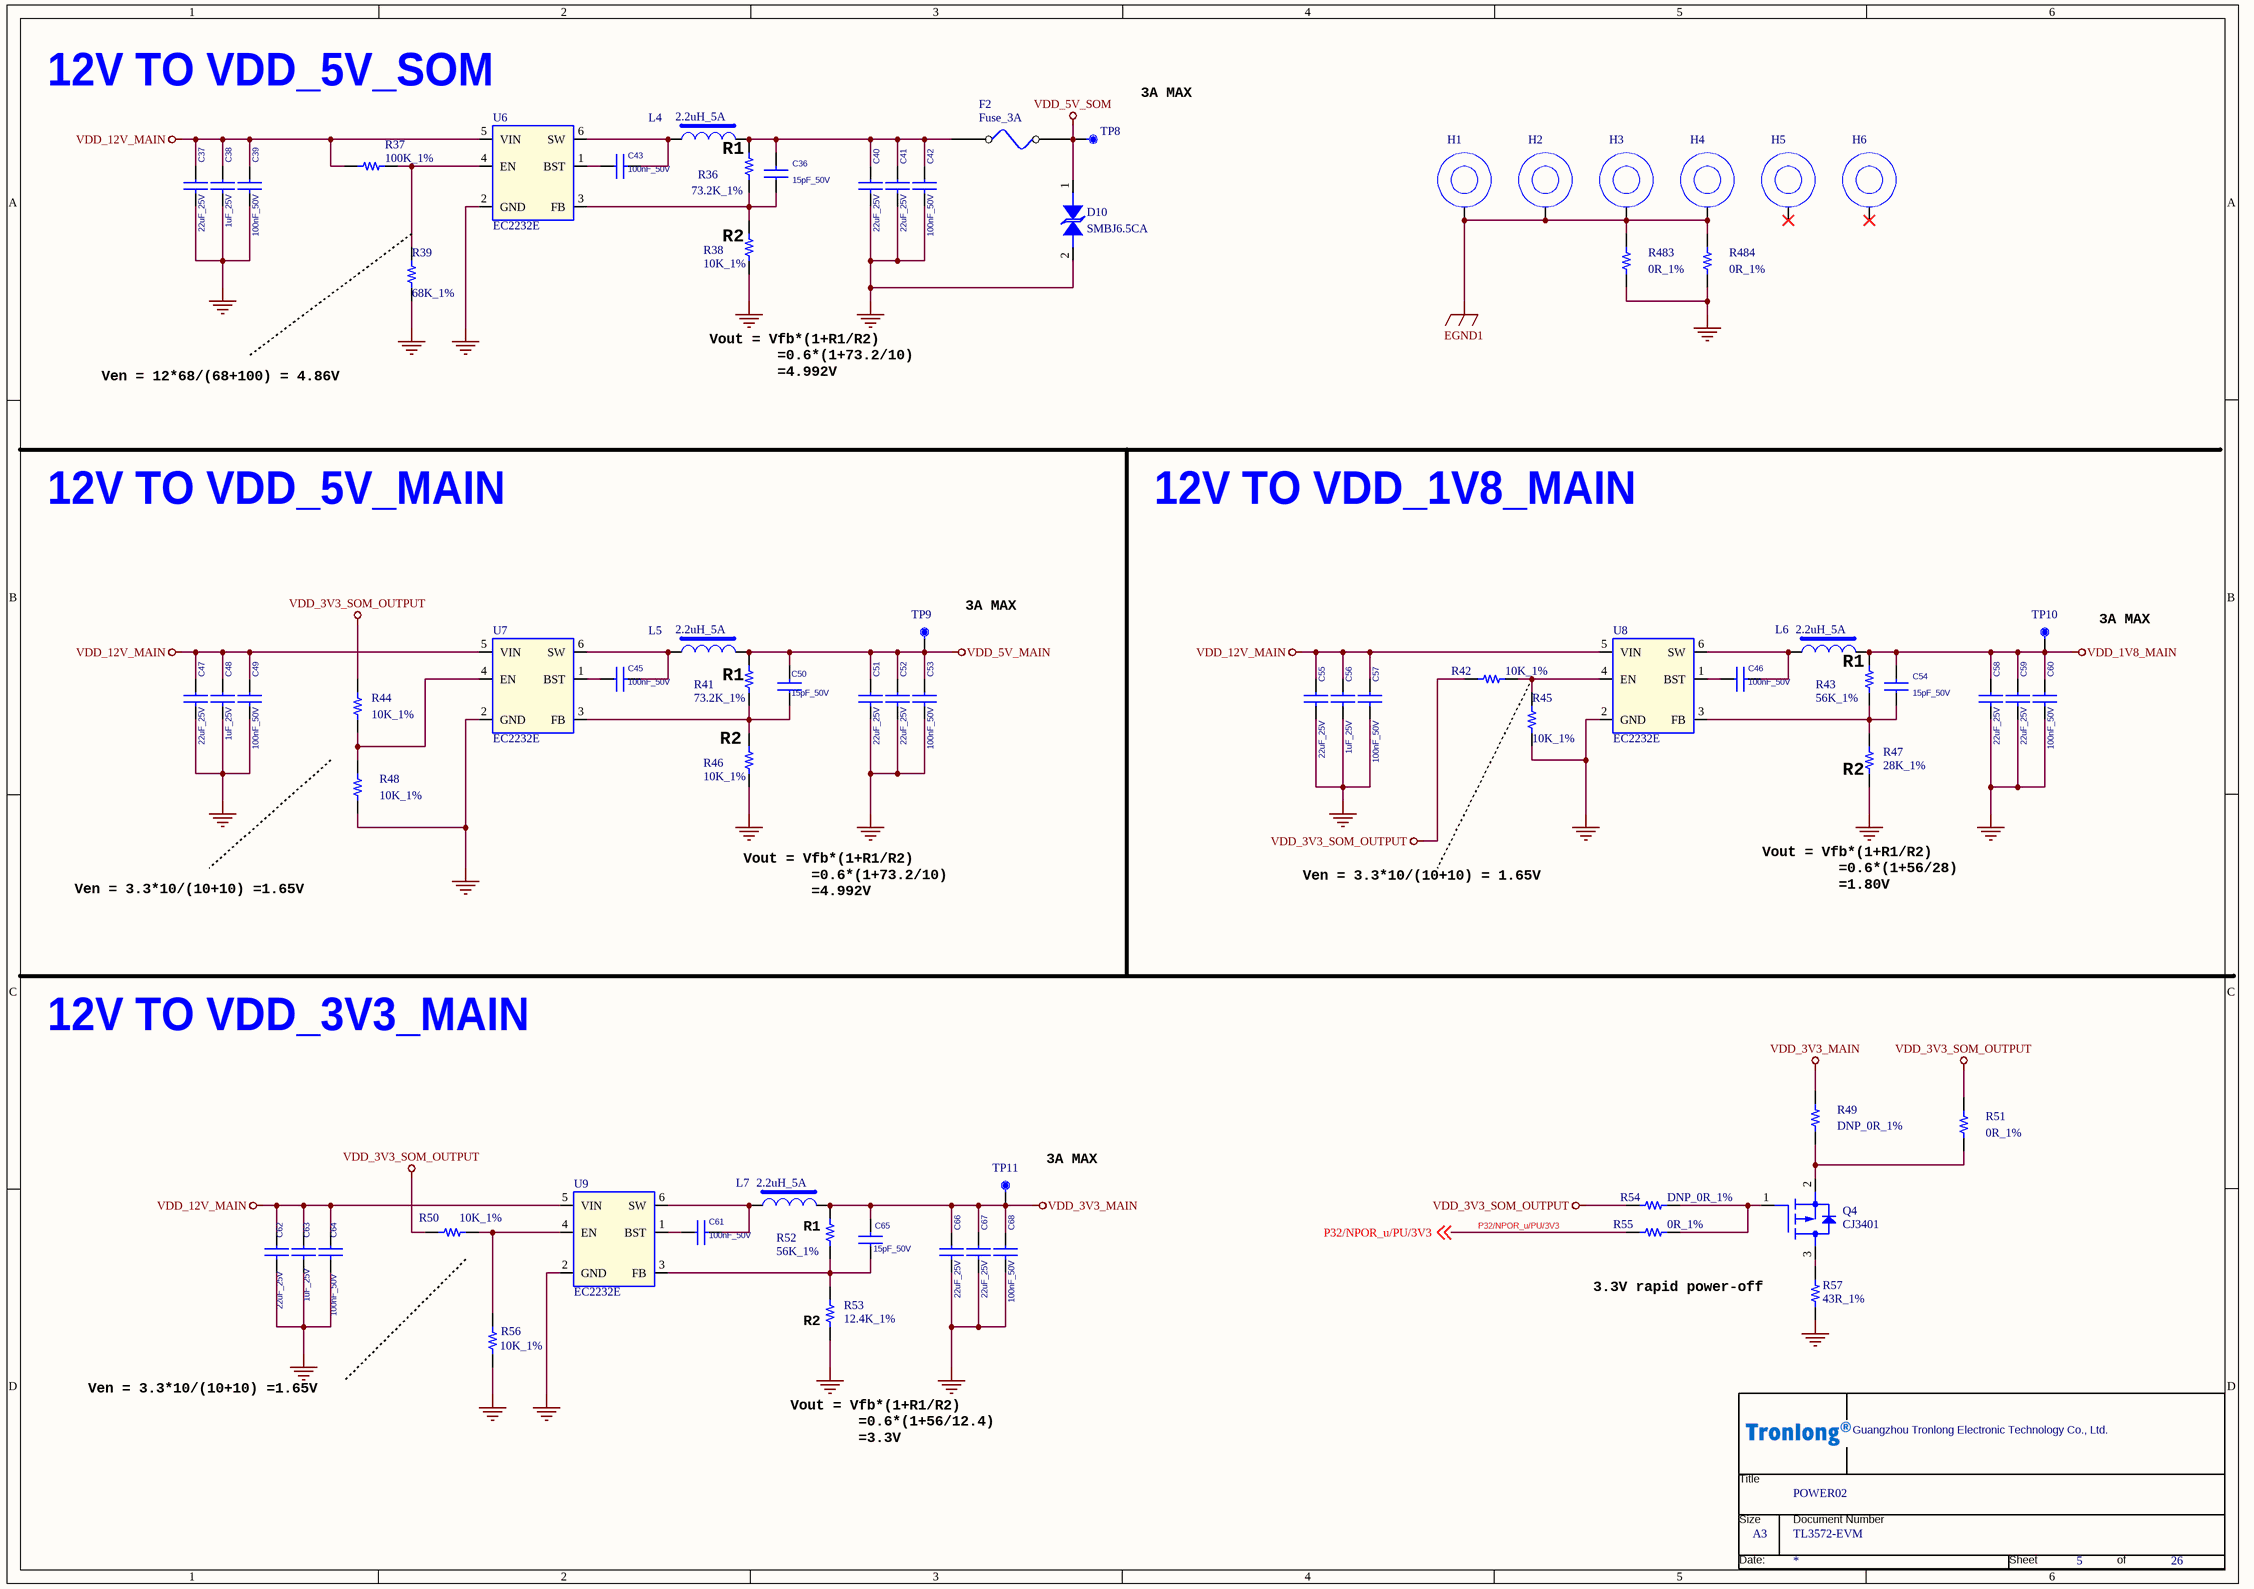
[diagram p7: P05_POWER02.SchDoc]

### Parts
(Parts that share a designator on the sheet are numbered #1, #2 ... from top to bottom, then left to right.)
*#3  Doc: TL3572-EVM  Title: POWER02  OrgName: Guangzhou Tronlong Electronic Technology Co., Ltd.  Page Size: A3  Page Number: 5  Page Count: 26  (hidden comment: Tronlong_TITTLE_20211115)  (graphical)
C36  15pF_50V  [C0603]
C37  22uF_25V  [C0805]
C38  1uF_25V  [C0402]
C39  100nF_50V  [C0402]
C40  22uF_25V  [C0805]
C41  22uF_25V  [C0805]
C42  100nF_50V  [C0402]
C43  100nF_50V  [C0402]
C45  100nF_50V  [C0402]
C46  100nF_50V  [C0402]
C47  22uF_25V  [C0805]
C48  1uF_25V  [C0402]
C49  100nF_50V  [C0402]
C50  15pF_50V  [C0603]
C51  22uF_25V  [C0805]
C52  22uF_25V  [C0805]
C53  100nF_50V  [C0402]
C54  15pF_50V  [C0603]
C55  22uF_25V  [C0805]
C56  1uF_25V  [C0402]
C57  100nF_50V  [C0402]
C58  22uF_25V  [C0805]
C59  22uF_25V  [C0805]
C60  100nF_50V  [C0402]
C61  100nF_50V  [C0402]
C62  22uF_25V  [C0805]
C63  1uF_25V  [C0402]
C64  100nF_50V  [C0402]
C65  15pF_50V  [C0603]
C66  22uF_25V  [C0805]
C67  22uF_25V  [C0805]
C68  100nF_50V  [C0402]
D10  SMBJ6.5CA  [SMB]
F2  Fuse_3A  [F1206]
H1  HOLE  [MHOLE_C200D125]  (value not drawn)
H2  HOLE  [MHOLE_C200D125]  (value not drawn)
H3  HOLE  [MHOLE_C200D125]  (value not drawn)
H4  HOLE  [MHOLE_C200D125]  (value not drawn)
H5  HOLE  [MHOLE_C200D125]  (value not drawn)
H6  HOLE  [MHOLE_C200D125]  (value not drawn)
L4  2.2uH_5A  [SMD-L4040M-2P]
L5  2.2uH_5A  [SMD-L4040M-2P]
L6  2.2uH_5A  [SMD-L4040M-2P]
L7  2.2uH_5A  [SMD-L4040M-2P]
Q4  CJ3401  [SOT23-3]
R36  73.2K_1%  [R0402]
R37  100K_1%  [R0402]
R38  10K_1%  [R0402]
R39  68K_1%  [R0402]
R41  73.2K_1%  [R0402]
R42  10K_1%  [R0402]
R43  56K_1%  [R0402]
R44  10K_1%  [R0402]
R45  10K_1%  [R0402]
R46  10K_1%  [R0402]
R47  28K_1%  [R0402]
R48  10K_1%  [R0402]
R49  DNP_0R_1%  [R0603]
R50  10K_1%  [R0402]
R51  0R_1%  [R0603]
R52  56K_1%  [R0402]
R53  12.4K_1%  [R0402]
R54  DNP_0R_1%  [R0402]
R55  0R_1%  [R0402]
R56  10K_1%  [R0402]
R57  43R_1%  [R0805]
R483  0R_1%  [R1206]
R484  0R_1%  [R1206]
TP8  SMT TP  [TP30]  (value not drawn)
TP9  SMT TP  [TP30]  (value not drawn)
TP10  SMT TP  [TP30]  (value not drawn)
TP11  SMT TP  [TP30]  (value not drawn)
U6  EC2232E  [SOT-23-6L]
U7  EC2232E  [SOT-23-6L]
U8  EC2232E  [SOT-23-6L]
U9  EC2232E  [SOT-23-6L]

### Nets
EGND1: H1.1 H2.1 H3.1 H4.1 R483.2 R484.2
GND: C37.2 C38.2 C39.2 C40.2 C41.2 C42.2 C47.2 C48.2 C49.2 C51.2 C52.2 C53.2 C55.2 C56.2 C57.2 C58.2 C59.2 C60.2 C62.2 C63.2 C64.2 C66.2 C67.2 C68.2 D10.2 R38.1 R39.1 R45.1 R46.1 R47.1 R48.1 R53.1 R56.1 R57.2 R483.1 R484.1 U6.2(GND) U7.2(GND) U8.2(GND) U9.2(GND)
VDD_1V8_MAIN: C54.2 C58.1 C59.1 C60.1 L6.2 R43.2 TP10.1
VDD_3V3_MAIN: C65.2 C66.1 C67.1 C68.1 L7.2 R49.2 R52.2 TP11.1
VDD_3V3_SOM_OUTPUT: R42.1 R44.2 R50.2 R51.2 R54.2
VDD_5V_MAIN: C50.2 C51.1 C52.1 C53.1 L5.2 R41.2 TP9.1
VDD_5V_SOM: D10.1 F2.2 TP8.1
VDD_12V_MAIN: C37.1 C38.1 C39.1 C47.1 C48.1 C49.1 C55.1 C56.1 C57.1 C62.1 C63.1 C64.1 R37.1 U6.5(VIN) U7.5(VIN) U8.5(VIN) U9.5(VIN)
P32/NPOR_u/PU/3V3: R55.2 ; off-sheet P32/NPOR_u/PU/3V3
NetC36_1: C36.1 R36.1 R38.2 U6.3(FB)
NetC36_2: C36.2 C40.1 C41.1 C42.1 F2.1 L4.2 R36.2
NetC43_1: C43.1 U6.1(BST)
NetC43_2: C43.2 L4.1 U6.6(SW)
NetC45_1: C45.1 U7.1(BST)
NetC45_2: C45.2 L5.1 U7.6(SW)
NetC46_1: C46.1 U8.1(BST)
NetC46_2: C46.2 L6.1 U8.6(SW)
NetC50_1: C50.1 R41.1 R46.2 U7.3(FB)
NetC54_1: C54.1 R43.1 R47.2 U8.3(FB)
NetC61_1: C61.1 U9.1(BST)
NetC61_2: C61.2 L7.1 U9.6(SW)
NetC65_1: C65.1 R52.1 R53.2 U9.3(FB)
NetQ4_1: Q4.1(GATE) R54.1 R55.1
NetQ4_2: Q4.2(SOURCE) R49.1 R51.1
NetQ4_3: Q4.3(DRAIN) R57.1
NetR37_2: R37.2 R39.2 U6.4(EN)
NetR42_2: R42.2 R45.2 U8.4(EN)
NetR44_1: R44.1 R48.2 U7.4(EN)
NetR50_1: R50.1 R56.2 U9.4(EN)

Not connected (* = marked no-connect by the designer): H5 1*; H6 1*

### Notes on the sheet
- 12V TO VDD_5V_SOM
- 3A MAX
- (near L4) R1
- (near R38) R2
- Ven = 12*68/(68+100) = 4.86V
- Vout = Vfb*(1+R1/R2)
  =0.6*(1+73.2/10)
  =4.992V
- 12V TO VDD_5V_MAIN
- 12V TO VDD_1V8_MAIN
- (near TP9) 3A MAX
- (near L6) R1
- R1
- (near R46) R2
- (near R47) R2
- Ven = 3.3*10/(10+10) =1.65V
- Ven = 3.3*10/(10+10) = 1.65V
- Vout = Vfb*(1+R1/R2)
  =0.6*(1+56/28)
  =1.80V
- 12V TO VDD_3V3_MAIN
- (near TP11) 3A MAX
- (near R53) R2
- 3.3V rapid power-off
- Vout = Vfb*(1+R1/R2)
  =0.6*(1+56/12.4)
  =3.3V
- (in symbol Tronlong_TITTLE_20211115) Title; Size; Document Number; Date:; Sheet; of

### Library data of the parts
*#3 = Tronlong_TITTLE_20211115: RevCode: A?; Page Create Date: March  8, 1995; Page Modify Date: *
C36 C50 = CAP NP_Dup2: CL10C150JB8NNNC,CC0603JRNPO9BN150; Manufacturer: 广州创龙; Manufacturer PartNumber: 15pF,5%,C0603,50V,（X7R,X5R,COG,NPO或X7S）; Eco-Label: ROHS; ERP Number: 005.0001.0022.00126; Operation Temperature（℃）: -40~+85(Ta); As-Welded: /; PCB Footprint: C0603; Part Status: -; Manufacturer Character: -; Temperature: -55~125℃
C37 = CAP NP_Dup2: 贴片陶瓷电容,22uF,20%,25V,X5R; Manufacturer Character: 中国大陆; Manufacturer: 广东风华高新科技股份有限公司（FH）; Manufacturer PartNumber: 0805X226M250NT; Eco-Label: ROHS; ERP Number: 005.0001.0001.00524; Operation Temperature（℃）: -55~+85(Ta); As-Welded: /; PCB Footprint: C0805; Part Status: 优选; Temperature: -55~125℃
C38 = CAP NP_Dup2: as C26 on sheet P04_POWER01; PCB Footprint: C0402; Part Status: 试用
C39 C43 = CAP NP_Dup2: 贴片陶瓷电容,100nF,10%,50V,X7R; Manufacturer: 广东风华高新科技股份有限公司（FH）; Manufacturer PartNumber: 0402B104K500NT; Manufacturer Character: 中国大陆; As-Welded: /; Operation Temperature（℃）: -55~+125(Ta); ERP Number: 005.0001.0001.00681; Eco-Label: ROHS; PCB Footprint: C0402; Temperature: -55~125℃; Part Status: 试用
C40 C41 C51 = CAP NP_Dup2: 贴片陶瓷电容,22uF,20%,25V,X5R; Manufacturer Character: 中国大陆; Manufacturer PartNumber: 0805X226M250NT; Manufacturer: 广东风华高新科技股份有限公司（FH）; Eco-Label: ROHS; ERP Number: 005.0001.0001.00524; Operation Temperature（℃）: -55~+85(Ta); As-Welded: /; PCB Footprint: C0805; Part Status: 优选; Temperature: -55~125℃
C42 C49 C53 = CAP NP_Dup2: 贴片陶瓷电容,100nF,10%,50V,X7R; Manufacturer Character: 中国大陆; Manufacturer: 广东风华高新科技股份有限公司（FH）; Manufacturer PartNumber: 0402B104K500NT; As-Welded: /; Operation Temperature（℃）: -55~+125(Ta); ERP Number: 005.0001.0001.00681; Eco-Label: ROHS; PCB Footprint: C0402; Temperature: -55~125℃; Part Status: 试用
C45 = CAP NP_Dup2: 贴片陶瓷电容,100nF,10%,50V,X7R; Manufacturer Character: 中国大陆; Manufacturer PartNumber: 0402B104K500NT; Manufacturer: 广东风华高新科技股份有限公司（FH）; As-Welded: /; Operation Temperature（℃）: -55~+125(Ta); ERP Number: 005.0001.0001.00681; Eco-Label: ROHS; PCB Footprint: C0402; Temperature: -55~125℃; Part Status: 试用
C46 = CAP NP_Dup2: 贴片陶瓷电容,100nF,10%,50V,X7R; Manufacturer Character: 中国大陆; Manufacturer: 广东风华高新科技股份有限公司（FH）; Manufacturer PartNumber: 0402B104K500NT; Eco-Label: ROHS; ERP Number: 005.0001.0001.00681; Characteristic: <Characteristic>; Operation Temperature（℃）: -55~+125(Ta); As-Welded: /; PCB Footprint: C0402; Temperature: -55~155℃; Part Status: 试用
C47 C52 = CAP NP_Dup2: as C29 on sheet P04_POWER01; PCB Footprint: C0805; Part Status: 优选; Temperature: -55~125℃
C48 = CAP NP_Dup2: 贴片陶瓷电容,1uF,10%,25V,X5R; Manufacturer Character: 中国大陆; Manufacturer PartNumber: 0402X105K250NT; Manufacturer: 广东风华高新科技股份有限公司（FH）; Eco-Label: ROHS; ERP Number: 005.0001.0001.00640; As-Welded: /; Operation Temperature（℃）: -55~+85(Ta); PCB Footprint: C0402; Part Status: 试用
C54 = CAP NP_Dup2: CL10C150JB8NNNC,CC0603JRNPO9BN150; Manufacturer PartNumber: 15pF,5%,C0603,50V,（X7R,X5R,COG,NPO或X7S）; Manufacturer: 广州创龙; As-Welded: /; Operation Temperature（℃）: -40~+85(Ta); ERP Number: 005.0001.0022.00126; Eco-Label: ROHS; PCB Footprint: C0603; Part Status: -; Temperature: -55~125℃; Manufacturer Character: -
C55 = CAP NP_Dup2: 贴片陶瓷电容,22uF,20%,25V,X5R; Manufacturer: 广东风华高新科技股份有限公司（FH）; Manufacturer PartNumber: 0805X226M250NT; Manufacturer Character: 中国大陆; As-Welded: /; Operation Temperature（℃）: -55~+85(Ta); Characteristic: <Characteristic>; ERP Number: 005.0001.0001.00524; Eco-Label: ROHS; PCB Footprint: C0805; Part Status: 优选; Temperature: -55~155℃
C56 = CAP NP_Dup2: 贴片陶瓷电容,1uF,10%,25V,X5R; Manufacturer PartNumber: 0402X105K250NT; Manufacturer: 广东风华高新科技股份有限公司（FH）; Manufacturer Character: 中国大陆; As-Welded: /; Operation Temperature（℃）: -55~+85(Ta); Characteristic: <Characteristic>; ERP Number: 005.0001.0001.00640; Eco-Label: ROHS; PCB Footprint: C0402; Part Status: 试用
C57 C60 = CAP NP_Dup2: 贴片陶瓷电容,100nF,10%,50V,X7R; Manufacturer PartNumber: 0402B104K500NT; Manufacturer: 广东风华高新科技股份有限公司（FH）; Manufacturer Character: 中国大陆; Eco-Label: ROHS; ERP Number: 005.0001.0001.00681; Operation Temperature（℃）: -55~+125(Ta); Characteristic: <Characteristic>; As-Welded: /; PCB Footprint: C0402; Temperature: -55~155℃; Part Status: 试用
C58 C59 = CAP NP_Dup2: as C28 on sheet P04_POWER01; PCB Footprint: C0805; Part Status: 优选; Temperature: -55~125℃
C61 = CAP NP_Dup2: 贴片陶瓷电容,100nF,10%,50V,X7R; Manufacturer Character: 中国大陆; Manufacturer PartNumber: 0402B104K500NT; Manufacturer: 广东风华高新科技股份有限公司（FH）; Eco-Label: ROHS; ERP Number: 005.0001.0001.00681; Operation Temperature（℃）: -55~+125(Ta); As-Welded: /; PCB Footprint: C0402; Temperature: -55~125℃; Part Status: 试用
C62 C66 C67 = CAP NP_Dup2: 贴片陶瓷电容,22uF,20%,25V,X5R; Manufacturer Character: 中国大陆; Manufacturer PartNumber: 0805X226M250NT; Manufacturer: 广东风华高新科技股份有限公司（FH）; As-Welded: /; Operation Temperature（℃）: -55~+85(Ta); ERP Number: 005.0001.0001.00524; Eco-Label: ROHS; PCB Footprint: C0805; Part Status: 优选; Temperature: -55~125℃
C63 = CAP NP_Dup2: as C21 on sheet P04_POWER01; PCB Footprint: C0402; Part Status: 试用
C64 = CAP NP_Dup2: 贴片陶瓷电容,100nF,10%,50V,X7R; Manufacturer Character: 中国大陆; Manufacturer: 广东风华高新科技股份有限公司（FH）; Manufacturer PartNumber: 0402B104K500NT; Eco-Label: ROHS; ERP Number: 005.0001.0001.00681; Operation Temperature（℃）: -55~+125(Ta); As-Welded: /; PCB Footprint: C0402; Temperature: -55~125℃; Part Status: 试用
C65 = CAP NP_Dup2: CL10C150JB8NNNC,CC0603JRNPO9BN150; Manufacturer: 广州创龙; Manufacturer PartNumber: 15pF,5%,C0603,50V,（X7R,X5R,COG,NPO或X7S）; As-Welded: /; Operation Temperature（℃）: -40~+85(Ta); ERP Number: 005.0001.0022.00126; Eco-Label: ROHS; PCB Footprint: C0603; Part Status: -; Manufacturer Character: -; Temperature: -55~125℃
C68 = CAP NP_Dup2: 贴片陶瓷电容,100nF,10%,50V,X7R; Manufacturer PartNumber: 0402B104K500NT; Manufacturer: 广东风华高新科技股份有限公司（FH）; Manufacturer Character: 中国大陆; Eco-Label: ROHS; ERP Number: 005.0001.0001.00681; Operation Temperature（℃）: -55~+125(Ta); As-Welded: /; PCB Footprint: C0402; Temperature: -55~125℃; Part Status: 试用
D10 = DIODE TVS BI-DIR: TVS二极管,VRWM=6.5V,VBR=7.22V,一组,双向; Manufacturer Character: 中国大陆; Manufacturer: 上海雷卯电子科技有限公司（Leiditech）; Operation Temperature（℃）: -55~+150(Tj); room: 6; ERP Number: 005.0001.0017.00087; Eco-Label: ROHS; As-Welded: /; PCB Footprint: SMB; Manufacturer PartNumber: SMBJ6.5CA; Part Status: 测评
F2 = FUSE: as F1 on sheet P04_POWER01; PCB Footprint: F1206; Part Status: 试用; Temperature: -55~125℃
H1-H6 = HOLE: Manufacturer Character: 中国大陆; Operation Temperature（℃）: /; As-Welded: DNP; PCB Footprint: MHOLE_C200D125
L4 = INDUCTOR: 贴片功率电感,2.2uH,0.048Ω,Isat=7.6A,Irms=5A; Manufacturer Character: 中国大陆; Manufacturer: 深圳顺络电子股份有限公司（Sunlord）; Manufacturer PartNumber: WPN4020H2R2MT; Parameter: L2520，奇力新一体成型电感，最大额定电流3A，内阻65毫欧，20%; Eco-Label: ROHS; ERP Number: 005.0001.0006.00163; As-Welded: /; Operation Temperature（℃）: -40~+125(Ta); PCB Footprint: SMD-L4040M-2P; Part Status: 试用; Temperature: -40~125℃
L5 = INDUCTOR: 贴片功率电感,2.2uH,0.048Ω,Isat=7.6A,Irms=5A; Manufacturer PartNumber: WPN4020H2R2MT; Manufacturer: 深圳顺络电子股份有限公司（Sunlord）; Manufacturer Character: 中国大陆; Parameter: L2520，奇力新一体成型电感，最大额定电流3A，内阻65毫欧，20%; Eco-Label: ROHS; ERP Number: 005.0001.0006.00163; Operation Temperature（℃）: -40~+125(Ta); As-Welded: /; PCB Footprint: SMD-L4040M-2P; Part Status: 试用; Temperature: -40~125℃
L6 L7 = INDUCTOR: 贴片功率电感,2.2uH,0.048Ω,Isat=7.6A,Irms=5A; Manufacturer PartNumber: WPN4020H2R2MT; Manufacturer: 深圳顺络电子股份有限公司（Sunlord）; Manufacturer Character: 中国大陆; Parameter: L2520，奇力新一体成型电感，最大额定电流3A，内阻65毫欧，20%; Operation Temperature（℃）: -40~+125(Ta); As-Welded: /; ERP Number: 005.0001.0006.00163; Eco-Label: ROHS; PCB Footprint: SMD-L4040M-2P; Part Status: 试用; Temperature: -40~125℃
Q4 = MOSFET P SOT: MOSFET,P沟道,VDSS=-30V,VGSS=±12V,ID=-4.2A,PD=0.35W,VGS(th)=-1.3V; Manufacturer Character: 中国大陆; Manufacturer: 江苏长晶科技股份有限公司（JSCJ）; As-Welded: /; Operation Temperature（℃）: -55~+150(Tj); room: DCIN; ERP Number: 005.0001.0009.00015; Eco-Label: ROHS; PCB Footprint: SOT23-3; Manufacturer PartNumber: CJ3401; Manufacturer Part Number: CJ3401; Temperature: -55~150℃; Part Status: 优选
R36 = Resistor_Dup3: RC0402FR-0773K2L,0402WGF7322TCE,RTT027322FTH; Manufacturer: 广州创龙; Manufacturer PartNumber: 73.2K,±1%,R0402,≥1/16W; CLASS: DISCRETE; As-Welded: /; Operation Temperature（℃）: -40~+85(Ta); ERP Number: 005.0001.0023.00234; Eco-Label: ROHS; PCB Footprint: R0402; Part Status: -; Temperature: -55~155℃; Manufacturer Character: -
R37 = Resistor_Dup3: RC0402FR-07100KL,0402WGF1003TCE; Manufacturer: 广州创龙; Manufacturer PartNumber: 100K,±1%,R0402,≥1/16W; CLASS: DISCRETE; Eco-Label: ROHS; ERP Number: 005.0001.0023.00025; Operation Temperature（℃）: -40~+85(Ta); As-Welded: /; PCB Footprint: R0402; Part Status: -; Manufacturer Character: -; Temperature: -55~155℃
R38 R44-R46 R48 = Resistor_Dup3: 贴片电阻,10K,±1%,1/16W; Manufacturer PartNumber: RC-02K1002FT; Manufacturer: 广东风华高新科技股份有限公司（FH）; Manufacturer Character: 中国大陆; CLASS: DISCRETE; Eco-Label: ROHS; ERP Number: 005.0001.0002.01326; Operation Temperature（℃）: -55~+125(Ta); As-Welded: /; PCB Footprint: R0402; Part Status: 优选
  R38 R45 R46: Temperature: -55~155℃
  R44 R48: Temperature: –55~155℃
R39 = Resistor_Dup3: 贴片电阻,68K,±1%,1/16W; Manufacturer Character: 中国大陆; Manufacturer PartNumber: RC-02K6802FT; Manufacturer: 广东风华高新科技股份有限公司（FH）; CLASS: DISCRETE; Eco-Label: ROHS; ERP Number: 005.0001.0002.01426; Operation Temperature（℃）: -55~+155(Ta); As-Welded: /; PCB Footprint: R0402; Part Status: 测评; Temperature: -55~155℃
R41 = Resistor_Dup3: RC0402FR-0773K2L,0402WGF7322TCE,RTT027322FTH; Manufacturer PartNumber: 73.2K,±1%,R0402,≥1/16W; Manufacturer: 广州创龙; CLASS: DISCRETE; Eco-Label: ROHS; ERP Number: 005.0001.0023.00234; Operation Temperature（℃）: -40~+85(Ta); As-Welded: /; PCB Footprint: R0402; Part Status: -; Manufacturer Character: -; Temperature: -55~155℃
R42 = Resistor_Dup3: 贴片电阻,10K,±1%,1/16W; Manufacturer PartNumber: RC-02K1002FT; Manufacturer: 广东风华高新科技股份有限公司（FH）; Manufacturer Character: 中国大陆; CLASS: DISCRETE; As-Welded: /; Operation Temperature（℃）: -55~+125(Ta); ERP Number: 005.0001.0002.01326; Eco-Label: ROHS; PCB Footprint: R0402; Part Status: 优选; Temperature: -55~155℃
R43 = Resistor_Dup3: RC0402FR-0756KL，0402WGF5602TCE; Manufacturer: 广州创龙; Manufacturer PartNumber: 56K,±1%,R0402,≥1/16W; CLASS: DISCRETE; As-Welded: /; Operation Temperature（℃）: -40~+85(Ta); ERP Number: 005.0001.0023.00207; Eco-Label: ROHS; PCB Footprint: R0402; Part Status: -; Temperature: -55~155℃; Manufacturer Character: -
R47 = Resistor_Dup3: 贴片电阻,28K,±1%,1/16W; Manufacturer PartNumber: RC-02K2802FT; Manufacturer: 广东风华高新科技股份有限公司（FH）; Manufacturer Character: 中国大陆; CLASS: DISCRETE; As-Welded: /; Operation Temperature（℃）: -55~+155(Ta); ERP Number: 005.0001.0002.01380; Eco-Label: ROHS; PCB Footprint: R0402; Part Status: 试用; Temperature: -55~155℃
R49 = Resistor_Dup3: 贴片电阻,0R,±1%,1/10W; Manufacturer Character: 中国大陆; Manufacturer PartNumber: RS-03000FT; Manufacturer: 广东风华高新科技股份有限公司（FH）; CLASS: DISCRETE; Eco-Label: ROHS; ERP Number: 005.0001.0002.00956; Operation Temperature（℃）: -55~+155(Ta); room: RS232; As-Welded: DNP; PCB Footprint: R0603; Part Status: 优选
R50 = Resistor_Dup3: 贴片电阻,10K,±1%,1/16W; Manufacturer Character: 中国大陆; Manufacturer PartNumber: RC-02K1002FT; Manufacturer: 广东风华高新科技股份有限公司（FH）; CLASS: DISCRETE; Eco-Label: ROHS; ERP Number: 005.0001.0002.01326; Operation Temperature（℃）: -55~+125(Ta); As-Welded: /; PCB Footprint: R0402; Temperature: –55~155℃; Part Status: 优选
R51 = Resistor_Dup3: 贴片电阻,0R,±1%,1/10W; Manufacturer: 广东风华高新科技股份有限公司（FH）; Manufacturer PartNumber: RS-03000FT; Manufacturer Character: 中国大陆; CLASS: DISCRETE; As-Welded: /; room: RS232; Operation Temperature（℃）: -55~+155(Ta); ERP Number: 005.0001.0002.00956; Eco-Label: ROHS; PCB Footprint: R0603; Part Status: 优选
R52 = Resistor_Dup3: RC0402FR-0756KL，0402WGF5602TCE; Manufacturer PartNumber: 56K,±1%,R0402,≥1/16W; Manufacturer: 广州创龙; CLASS: DISCRETE; As-Welded: /; Operation Temperature（℃）: -40~+85(Ta); ERP Number: 005.0001.0023.00207; Eco-Label: ROHS; PCB Footprint: R0402; Part Status: -; Manufacturer Character: -; Temperature: -55~155℃
R53 = Resistor_Dup3: 0402WGF1242TCE; Manufacturer PartNumber: 12.4K,±1%,R0402,≥1/16W; Manufacturer: 广州创龙; CLASS: DISCRETE; Eco-Label: ROHS; ERP Number: 005.0001.0023.00040; Operation Temperature（℃）: -40~+85(Ta); As-Welded: /; PCB Footprint: R0402; Manufacturer Character: -; Temperature: -55~155℃; Part Status: -
R54 = Resistor_Dup3: 贴片电阻,0R,±1%,1/16W; Manufacturer: 广东风华高新科技股份有限公司（FH）; Manufacturer PartNumber: RC-02000FT; Manufacturer Character: 中国大陆; CLASS: DISCRETE; Operation Temperature（℃）: -55~+155(Ta); As-Welded: DNP; ERP Number: 005.0001.0002.00938; Eco-Label: ROHS; PCB Footprint: R0402; Part Status: 优选
R55 = Resistor_Dup3: 贴片电阻,0R,±1%,1/16W; Manufacturer: 广东风华高新科技股份有限公司（FH）; Manufacturer PartNumber: RC-02000FT; Manufacturer Character: 中国大陆; CLASS: DISCRETE; Operation Temperature（℃）: -55~+155(Ta); As-Welded: /; ERP Number: 005.0001.0002.00938; Eco-Label: ROHS; PCB Footprint: R0402; Part Status: 优选
R56 = Resistor_Dup3: 贴片电阻,10K,±1%,1/16W; Manufacturer: 广东风华高新科技股份有限公司（FH）; Manufacturer PartNumber: RC-02K1002FT; Manufacturer Character: 中国大陆; CLASS: DISCRETE; As-Welded: /; Operation Temperature（℃）: -55~+125(Ta); ERP Number: 005.0001.0002.01326; Eco-Label: ROHS; PCB Footprint: R0402; Part Status: 优选; Temperature: –55~155℃
R57 = Resistor_Dup3: 贴片电阻,43R,±1%,1/8W; Manufacturer Character: 中国大陆; Manufacturer PartNumber: RS-05K43R0FT; Manufacturer: 广东风华高新科技股份有限公司（FH）; CLASS: DISCRETE; As-Welded: /; Operation Temperature（℃）: -55~+125(Ta); room: DCIN; ERP Number: 005.0001.0002.01306; Eco-Label: ROHS; PCB Footprint: R0805; Temperature: -55~155℃; Part Status: 试用
R483 = Resistor_Dup3: as R12 on sheet P04_POWER01; PCB Footprint: R1206; Part Status: 测评
R484 = Resistor_Dup3: as R10 on sheet P04_POWER01; PCB Footprint: R1206; Part Status: 测评
TP8-TP11 = TP-S40: as TP7 on sheet P04_POWER01; PCB Footprint: TP30; Operation Temperature（℃）: /; Manufacturer: /; Manufacturer PartNumber: /
U6 U9 = WD1304E30: DC/DC,Buck,Vin:4.5V~17V,Vout:0.6V~6V,3A,1·; Manufacturer Character: 中国大陆; Manufacturer: 上海芯强微电子股份有限公司（Ecranic）; As-Welded: /; Operation Temperature（℃）: -40~+85(Ta); ERP Number: 005.0001.0004.00889; Eco-Label: ROHS; PCB Footprint: SOT-23-6L; Temperature: -40~85℃; Manufacturer PartNumber: EC2232E; Part Status: 试用
U7 = WD1304E30: DC/DC,Buck,Vin:4.5V~17V,Vout:0.6V~6V,3A,1·; Manufacturer Character: 中国大陆; Manufacturer: 上海芯强微电子股份有限公司（Ecranic）; Eco-Label: ROHS; ERP Number: 005.0001.0004.00889; Operation Temperature（℃）: -40~+85(Ta); As-Welded: /; PCB Footprint: SOT-23-6L; Part Status: 试用; Temperature: -40~85℃; Manufacturer PartNumber: EC2232E
U8 = WD1304E30_0_Dup1: DC/DC,Buck,Vin:4.5V~17V,Vout:0.6V~6V,3A,1·; Manufacturer: 上海芯强微电子股份有限公司（Ecranic）; Manufacturer Character: 中国大陆; As-Welded: /; Operation Temperature（℃）: -40~+85(Ta); ERP Number: 005.0001.0004.00889; Eco-Label: ROHS; PCB Footprint: SOT-23-6L; Part Status: 试用; Manufacturer PartNumber: EC2232E; Temperature: -40~125℃